# Altium schematic sheet Sheet4.SchDoc
size A4
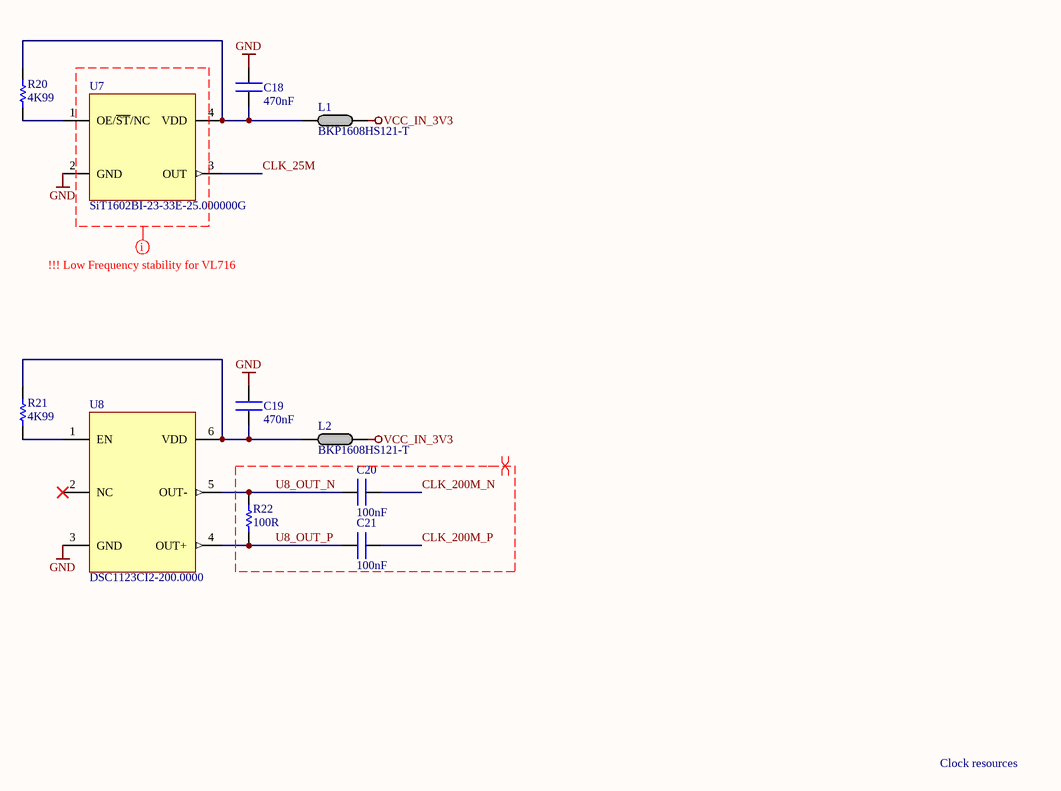
[diagram p0: Sheet4.SchDoc]

## Parts
C18  470nF  [CAPC1005X05N]
C19  470nF  [CAPC1005X05N]
C20  100nF  [CAPC1005X05N]
C21  100nF  [CAPC1005X05N]
L1  BKP1608HS121-T  [INDC1608X08N]
L2  BKP1608HS121-T  [INDC1608X08N]
R20  4K99  [RESC1005X05N]
R21  4K99  [RESC1005X05N]
R22  100R  [RESC1005X05N]
U7  SiT1602BI-23-33E-25.000000G  [SiT1602BI-23-33E-25.000000G]
U8  DSC1123CI2-200.0000  [DSC1123CI2-200.0000]

## Nets
GND: C18.2 C19.2 U7.2(GND) U8.3(GND)
VCC_IN_3V3: L1.2 L2.2
CLK_25M: U7.3(OUT)
CLK_200M_N: C20.1
CLK_200M_P: C21.1
U8_OUT_N: C20.2 R22.1 U8.5(OUT-)
U8_OUT_P: C21.2 R22.2 U8.4(OUT+)
NetC18_1: C18.1 L1.1 R20.1 U7.4(VDD)
NetC19_1: C19.1 L2.1 R21.1 U8.6(VDD)
NetR20_2: R20.2 U7.1(OE/~{ST}/NC)
NetR21_2: R21.2 U8.1(EN)

Not connected (* = marked no-connect by the designer): U8 2(NC)*

## Layout directives
differential pair: CLK_200M_N, CLK_200M_P, U8_OUT_N, U8_OUT_P
mark named !!! Low Frequency stability for VL716: (no net found under the mark)

## Notes on the sheet
- Clock resources

## Library data of the parts
C18-C21 = C0402: Ceramic Chip Capacitor
  C18 C19: Value: 470nF
  C20 C21: Value: 100nF
L1 L2 = BKP1608HS121-T: MULTILAYER CHIP BEAD INDUCTOR FOR POWER LINES
R20-R22 = R0402: Ceramic Chip Resistor
  R20 R21: Value: 4K99
  R22: Value: 100R
U7 = SiT1602BI-23-33E-25.000000G: Low Power, Standard Frequency Oscillator
U8 = DSC1123CI2-200.0000: Low-Jitter Precision LVDS Oscillator